# EAGLE design esp-12-f-breakout-ch340g (EAGLE 7.5.0)
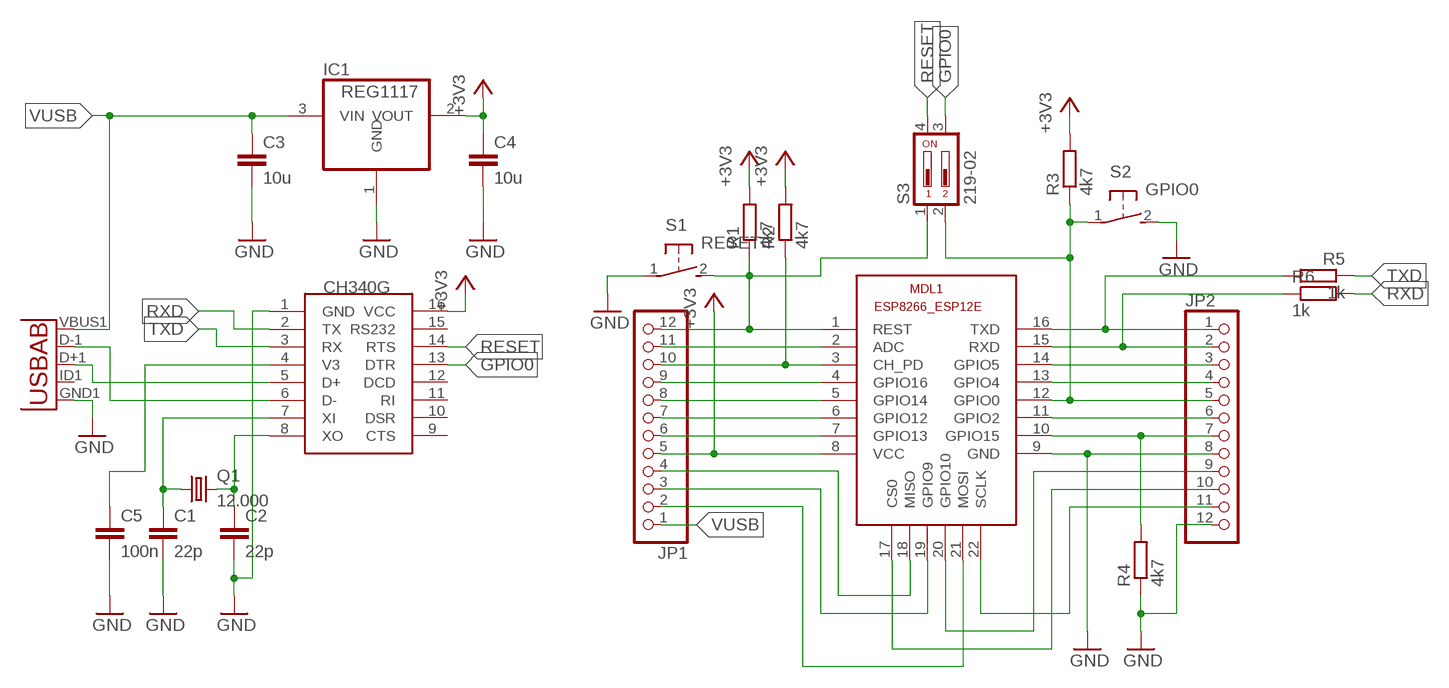
[diagram p0: schematic, sheet 1]

## Parts
C1  22p  C-EUC0805  [C0805]
C2  22p  C-EUC0805  [C0805]
C3  10u  C-EUC0805  [C0805]
C4  10u  C-EUC0805  [C0805]
C5  100n  C-EUC0805  [C0805]
IC1  REG1117  [SOT223]
JP1  PINHD-1X12  [1X12]
JP2  PINHD-1X12  [1X12]
MDL1  ESP8266-12EESP8266-ESP12E  [ESP8266-ESP12E]
Q1  12.000  CRYSTALHC49UP  [HC49UP]
R1  4k7  R-EU_M0805  [M0805]
R2  4k7  R-EU_M0805  [M0805]
R3  4k7  R-EU_M0805  [M0805]
R4  4k7  R-EU_M0805  [M0805]
R5  1k  R-EU_M0805  [M0805]
R6  1k  R-EU_M0805  [M0805]
S1  RESET  DTSM-3  [DTSM-3]
S2  GPIO0  DTSM-3  [DTSM-3]
S3  219-02  [CTS-219-02]
U2  USB""  [USB-MICRO-SMD]
U$2  CH340G  [SOIC16]

## Nets
+3V3: C4.1 IC1.2(VOUT) JP1.5 MDL1.8(VCC) R1.2 R2.2 R3.2 U$2.16(VCC)
GND: C1.2 C2.2 C3.2 C4.2 C5.2 IC1.1(GND) JP2.8 JP2.12 MDL1.9(GND) R4.1 S1.1 S2.2 U2.GND1(GND) U$2.1(GND)
GPIO0: S3.3 U$2.13(DTR)
N$1: JP1.12 MDL1.1(REST) R1.1 S1.2 S3.1
N$2: JP1.11 MDL1.2(ADC)
N$3: JP1.10 MDL1.3(CH_PD) R2.1
N$4: JP1.9 MDL1.4(GPIO16)
N$5: JP1.8 MDL1.5(GPIO14)
N$6: JP1.7 MDL1.6(GPIO12)
N$7: JP1.6 MDL1.7(GPIO13)
N$8: JP1.4 MDL1.18(MISO)
N$9: C5.1 U$2.4(V3)
N$11: JP1.3 MDL1.19(GPIO9)
N$12: JP2.9 MDL1.20(GPIO10)
N$13: JP2.10 MDL1.17(CS0)
N$14: JP2.11 MDL1.22(SCLK)
N$15: JP1.2 MDL1.21(MOSI)
N$16: JP2.7 MDL1.10(GPIO15) R4.2
N$17: JP2.6 MDL1.11(GPIO2)
N$18: JP2.5 MDL1.12(GPIO0) R3.1 S2.1 S3.2
N$19: JP2.4 MDL1.13(GPIO4)
N$20: JP2.3 MDL1.14(GPIO5)
N$21: JP2.2 MDL1.15(RXD) R6.1
N$22: JP2.1 MDL1.16(TXD) R5.2
N$23: C1.1 Q1.1 U$2.7(XI)
N$24: C2.1 Q1.2 U$2.8(XO)
N$25: U2.D-1(D-) U$2.6(D-)
N$26: U2.D+1(D+) U$2.5(D+)
RESET: S3.4 U$2.14(RTS)
RXD: R6.2 U$2.2(TX)
TXD: R5.1 U$2.3(RX)
VUSB: C3.1 IC1.3(VIN) JP1.1 U2.VBUS1(VBUS)
Unconnected: U2.ID1(USBID) U$2.9(CTS) U$2.10(DSR) U$2.11(RI) U$2.12(DCD) U$2.15(RS232)

## Library data of the parts
C1-C5 = rcl:C-EU: CAPACITOR, European symbol
IC1 = burr-brown:REG1117: 800mA and 1A Low Dropout (LDO) Positive Regulator 1.8V, 2.5V, 2.85V, 3.3V, 5V, and Adj; MPN: REG1117; OC_FARNELL: 1097566; OC_NEWARK: 14P6981
JP1 JP2 = pinhead:PINHD-1X12: PIN HEADER
MDL1 = ESP8266-ESP12E:ESP8266-12E: ESP8266-12E with additional I/O and GPIO04/05 corrected The author cannot warrant that this library is free from error or will meet your specific requirements. Created by PuceBaboon.com. Komagane, Nagano, JAPAN
Q1 = crystal:CRYSTAL: CRYSTAL; OC_FARNELL: unknown; OC_NEWARK: unknown
R1-R6 = rcl:R-EU_: RESISTOR, European symbol
S1 S2 = switch-tact:DTSM-3
S3 = switch-dil:219-02*: Surface Mount DIP Switch Series 219 SMT CTS Electronic Components Sourc: www.ctscorp.com; OC_FARNELL: unknown; OC_NEWARK: unknown
U2 = MicroUSB:USB: This is a USB AB connector that is compatible with USB OTG. i.e. this connector can serve as a host or device
U$2 = ch340g:CH340G

## Net classes
0 default: width 0.305 mm, clearance 0.254 mm

## Board
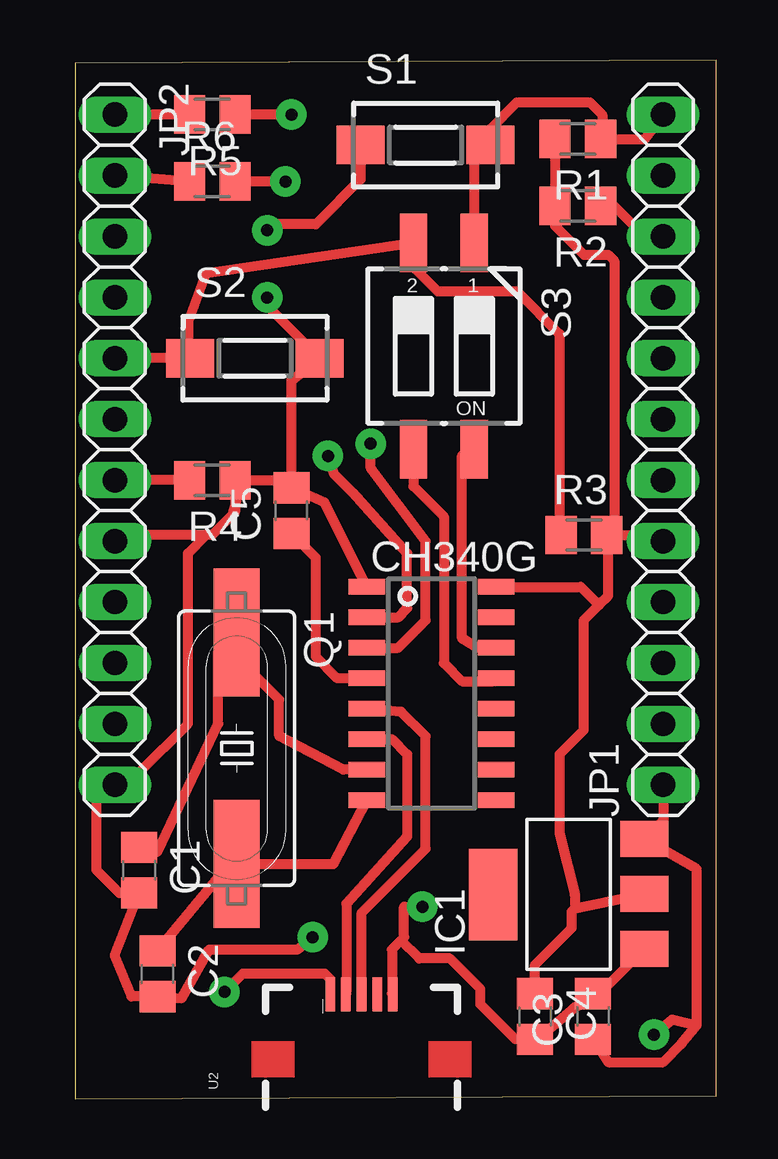
[diagram p1: board, top side]
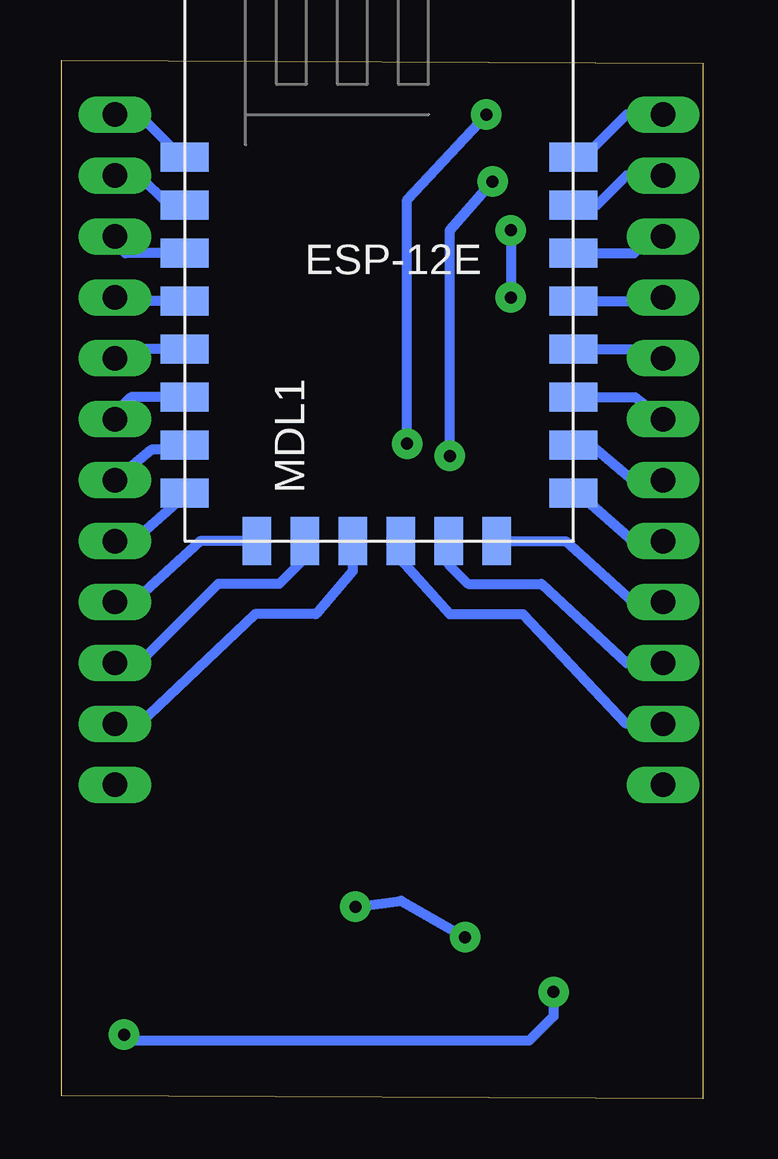
[diagram p2: board, bottom side, seen from below]

Size 26.72 x 43.3 mm. Coordinates in mm from the lower left corner, seen from the top.
Outline: 0,0 26.72,0.13 26.72,43.3 0,43.17 0,0
Copper layers (1*16): Top 0.035mm / dielectric 1.5mm / Bottom 0.035mm
Design rules "default": minimum track width 10mil, minimum drill 24mil, track to track 8mil, track to pad 8mil, pad to pad 8mil, via to via 8mil, smd to smd 8mil, copper to edge 40mil, drill to drill 8mil, minimum pad ring 10mil, minimum via ring 8mil, stop-mask expansion 4mil, vias tented up to drill 0mil, thermal gap 10mil

### Footprints (pad centres in the part's own frame; a part is rotated, then mirrored left to right if it is on the bottom)
C0805 = smd 1.3 x 1.5: 1 -0.95,0; 2 0.95,0
SOT223 = smd 1.499 x 2.007: 1 -2.261,-3.15; 2 0.025,-3.15; 3 2.311,-3.15 | smd 3.81 x 2.007: 4 0,3.15
1X12 = drill 1.016 long: 1 -13.97,0; 2 -11.43,0; 3 -8.89,0; 4 -6.35,0; 5 -3.81,0; 6 -1.27,0; 7 1.27,0; 8 3.81,0; 9 6.35,0; 10 8.89,0; 11 11.43,0; 12 13.97,0
ESP8266-ESP12E = smd 2 x 1.2: 1 0,16; 2 0,14; 3 0,12; 4 0,10; 5 0,8; 6 0,6; 7 0,4; 8 0,2; 9 16.2,2; 10 16.2,4; 11 16.2,6; 12 16.2,8; 13 16.2,10; 14 16.2,12; 15 16.2,14; 16 16.2,16 | smd 1.2 x 2: 17 11,0; 18 3,0; 19 5,0; 20 13,0; 21 7,0; 22 9,0
HC49UP = smd 5.334 x 1.93: 1 -4.826,0; 2 4.826,0
M0805 = smd 1.3 x 1.6: 1 -0.95,0; 2 0.95,0
DTSM-3 = smd 2 x 1.6: 1 -2.7,0; 2 2.7,0
CTS-219-02 = smd 1.13 x 2.44: 1 -1.27,-4.3; 2 1.27,-4.3; 3 1.27,4.3; 4 -1.27,4.3
USB-MICRO-SMD = smd 1.4 x 0.4: D+1 2.7,0; D-1 2.7,0.65; GND1 2.7,-1.3; ID1 2.7,-0.65; VBUS1 2.7,1.3
SOIC16 = smd 0.635 x 1.524: 1 -4.445,-2.695; 2 -3.175,-2.695; 3 -1.905,-2.695; 4 -0.635,-2.695; 5 0.635,-2.695; 6 1.905,-2.695; 7 3.175,-2.695; 8 4.445,-2.695; 9 4.445,2.695; 10 3.175,2.695; 11 1.905,2.695; 12 0.635,2.695; 13 -0.635,2.695; 14 -1.905,2.695; 15 -3.175,2.695; 16 -4.445,2.695

### Placement (x,y rotation side)
C1  2.67,9.53 270 top
C2  3.43,5.21 270 top
C3  21.59,3.43 90 top
C4  19.18,3.43 270 top
C5  9.02,24.51 90 top
IC1  20.57,8.51 90 top
JP1  24.51,27.05 90 top
JP2  1.65,27.05 270 top
MDL1  21.59,23.24 0 bottom
Q1  6.73,14.61 270 top
R1  20.96,40.01 180 top
R2  20.96,37.21 180 top
R3  21.21,23.49 0 top
R4  5.71,25.78 180 top
R5  5.71,41.02 180 top
R6  5.71,38.23 0 top
S1  14.61,39.75 0 top
S2  7.49,30.86 0 top
S3  15.37,31.37 180 top
U2  11.94,1.65 90 top
U$1  [MITSUDOMOE]  13.21,14.61 0 bottom
U$2  14.86,16.89 270 top

### Tracks (layer width: path | path; a pad name or v marks a point on that pad's centre or on a via)
+3V3
  Top 0.406: R3.2 24.51,23.49 JP1.5 | R1.2 R2.2 20,36.38 21.21,35.18 22.23,35.18 22.48,34.93 22.48,23.81 R3.2 | 21.84,20.57 21.2,19.93 21.2,15.36 20.19,14.35 20.19,11.05 20.83,8.51 20.83,7.92 | 21.84,20.57 22.23,20.95 22.23,23.43 R3.2 | 20.83,7.92 IC1.2 | U$2.16 21.08,21.34 21.84,20.57 | C4.1 19.18,5.59 20.7,7.11 20.7,7.8 20.83,7.92
  Bottom 0.406: MDL1.8 21.59,25.15 23.75,23.24 JP1.5
GND  (via drill 0.5 pad 1.27)
  Top 0.406: C5.2 9.08,25.78 R4.1 6.67,24.45 | C5.2 9.02,29.94 S2.2 8,33.05 v8,33.4 | 13.59,6.6 13.72,6.73 13.72,8 v14.48,8 | 13.59,6.6 13.21,6.22 13.21,4.38 U2.GND1 | v9.91,6.73 9.27,6.22 5.59,6.22 4.45,4.19 C2.2 2.35,4.26 1.65,5.97 C1.2 1.84,8.58 0.89,9.53 0.89,12.83 1.65,13.59 1.91,13.59 | S1.1 11.9,38.32 10.03,36.45 8.25,36.45 v8,36.2 | 6.67,24.45 5.71,23.49 5.46,23.49 | 5.46,23.49 2.16,23.49 JP2.8 | 6.73,25.02 6.6,24.51 6.67,24.45 | U$2.1 10.39,24.85 C5.2 | 1.91,13.59 2.67,13.59 4.7,15.62 4.7,22.73 5.46,23.49 | IC1.1 21.85,4.38 C3.2 21.15,3.94 20.83,3.81 19.24,2.48 C4.2 18.35,2.48 16.89,3.94 16.89,4.57 15.62,5.84 14.35,5.84 13.59,6.6 | JP2.12 1.65,13.34 1.91,13.59
  Bottom 0.406: MDL1.9 5.17,25.24 2.92,23.24 JP2.8 | v8,36.2 v8,33.4 | v14.48,8 12.57,8.26 v9.91,6.73
GPIO0
  Top 0.406: S3.3 14.1,25.53 15.37,24.26 15.37,18.16 16.13,17.4 17.43,17.4 U$2.13
N$1
  Top 0.406: S3.1 16.64,39.08 S1.2 17.3,40.42 18.41,41.53 21.46,41.53 21.97,41.02 21.97,40.07 R1.1 23.75,40.01 JP1.12
  Bottom 0.406: MDL1.1 21.71,39.24 23.5,41.02 JP1.12
N$2
  Bottom 0.406: MDL1.2 22.25,37.24 23.5,38.48 JP1.11
N$3
  Top 0.406: R2.1 22.48,37.21 23.75,35.94 JP1.10
  Bottom 0.406: MDL1.3 24.07,35.24 JP1.10
N$4
  Bottom 0.406: MDL1.4 24.51,33.24 | 24.51,33.24 24.61,33.24 | JP1.9 24.51,33.24
N$5
  Bottom 0.406: MDL1.5 24.39,31.24 24.51,31.11 JP1.8
N$6
  Bottom 0.406: MDL1.6 23.84,29.24 24.51,28.57 JP1.7
N$7
  Bottom 0.406: MDL1.7 22.04,27.24 22.23,27.05 22.99,27.05 JP1.6
N$8
  Bottom 0.406: MDL1.18 20.96,23.24 23.75,20.7 JP1.4
N$9
  Top 0.406: U$2.4 10.92,17.53 10.03,18.41 10.03,22.54 C5.1
N$11
  Bottom 0.406: MDL1.19 16.59,22.53 17.65,21.46 20.19,21.46 23.75,17.91 JP1.3
N$12
  Bottom 0.406: MDL1.20 5.71,23.24 2.92,20.7 JP2.9
N$13
  Bottom 0.406: MDL1.17 10.59,22.27 9.78,21.46 6.73,21.46 3.17,18.16 JP2.10
N$14
  Bottom 0.406: MDL1.22 12.59,22.5 10.54,20.19 7.49,20.19 3.17,15.62 JP2.11
N$15
  Bottom 0.406: MDL1.21 14.59,21.99 16.13,20.19 18.67,20.19 23.5,15.62 23.75,15.37 JP1.2
N$16
  Top 0.406: R4.2 JP2.7
  Bottom 0.406: MDL1.10 4.63,27.24 2.92,25.78 JP2.7
N$17
  Bottom 0.406: MDL1.11 2.83,29.24 JP2.6
N$18
  Top 0.406: R3.1 20.19,23.56 20.19,31.88 18.41,33.66 15.11,33.66 14.1,34.67 S3.2 5.44,34.4 4.7,32.39 4.7,30.95 S2.1 JP2.5
  Bottom 0.406: MDL1.12 2.29,31.24 JP2.5
N$19
  Bottom 0.406: MDL1.13 1.81,33.24 1.72,33.27 JP2.4
N$20
  Bottom 0.406: MDL1.14 2.86,35.24 2.16,35.94 JP2.3
N$21
  Top 0.406: R6.1 JP2.2
  Bottom 0.406: MDL1.15 4.42,37.24 3.17,38.48 JP2.2
N$22
  Top 0.406: R5.2 JP2.1
  Bottom 0.406: MDL1.16 4.96,39.24 3.17,41.02 JP2.1
N$23
  Top 0.406: C1.1 3.43,10.29 5.97,15.62 5.97,18.67 6.22,18.92 | 6.22,18.92 Q1.1 | U$2.7 11.18,13.72 8.51,15.11 8.51,16.64 6.22,18.92
N$24
  Top 0.406: C2.1 6.16,9.46 Q1.2 10.77,9.78 U$2.8
N$25
  Top 0.406: U$2.6 13.21,14.99 13.84,14.35 13.84,10.92 11.3,8.13 11.3,4.59 U2.D-1
N$26
  Top 0.406: U2.D+1 11.94,7.75 14.61,10.41 14.61,15.11 13.59,16.13 13.56,16.13 U$2.5
RESET
  Top 0.406: U$2.14 16.76,18.8 16.13,19.18 16.13,26.81 S3.4
RXD  (via drill 0.5 pad 1.27)
  Top 0.406: v8.76,38.23 R6.2 | U$2.2 13.46,20.07 13.84,20.45 13.84,22.73 11.56,25.27 10.79,26.04 v10.54,26.8
  Bottom 0.406: v10.54,26.8 10.54,36.2 v8.76,38.23
TXD  (via drill 0.5 pad 1.27)
  Top 0.406: 6.99,40.77 6.73,41.02 R5.1 v9.02,41.02 | U$2.3 13.46,18.8 14.61,19.94 14.61,23.24 12.32,26.29 v12.32,27.3
  Bottom 0.406: v12.32,27.3 12.32,37.47 v9.02,41.02
VUSB  (via drill 0.5 pad 1.27)
  Top 0.406: C3.1 22.23,1.52 24.51,1.52 25.27,2.29 25.91,3.05 | 25.91,3.05 25.91,9.58 IC1.3 24.51,11.61 JP1.1 | U2.VBUS1 10.64,4.98 10.41,5.21 6.99,5.21 v6.22,4.44 | v24.13,2.67 24.89,3.3 25.91,3.05
  Bottom 0.406: v6.22,4.44 6.22,3.43 7.24,2.41 23.88,2.41 v24.13,2.67